# EAGLE design CAN Tester Board Rev3 (EAGLE 9.6.2)
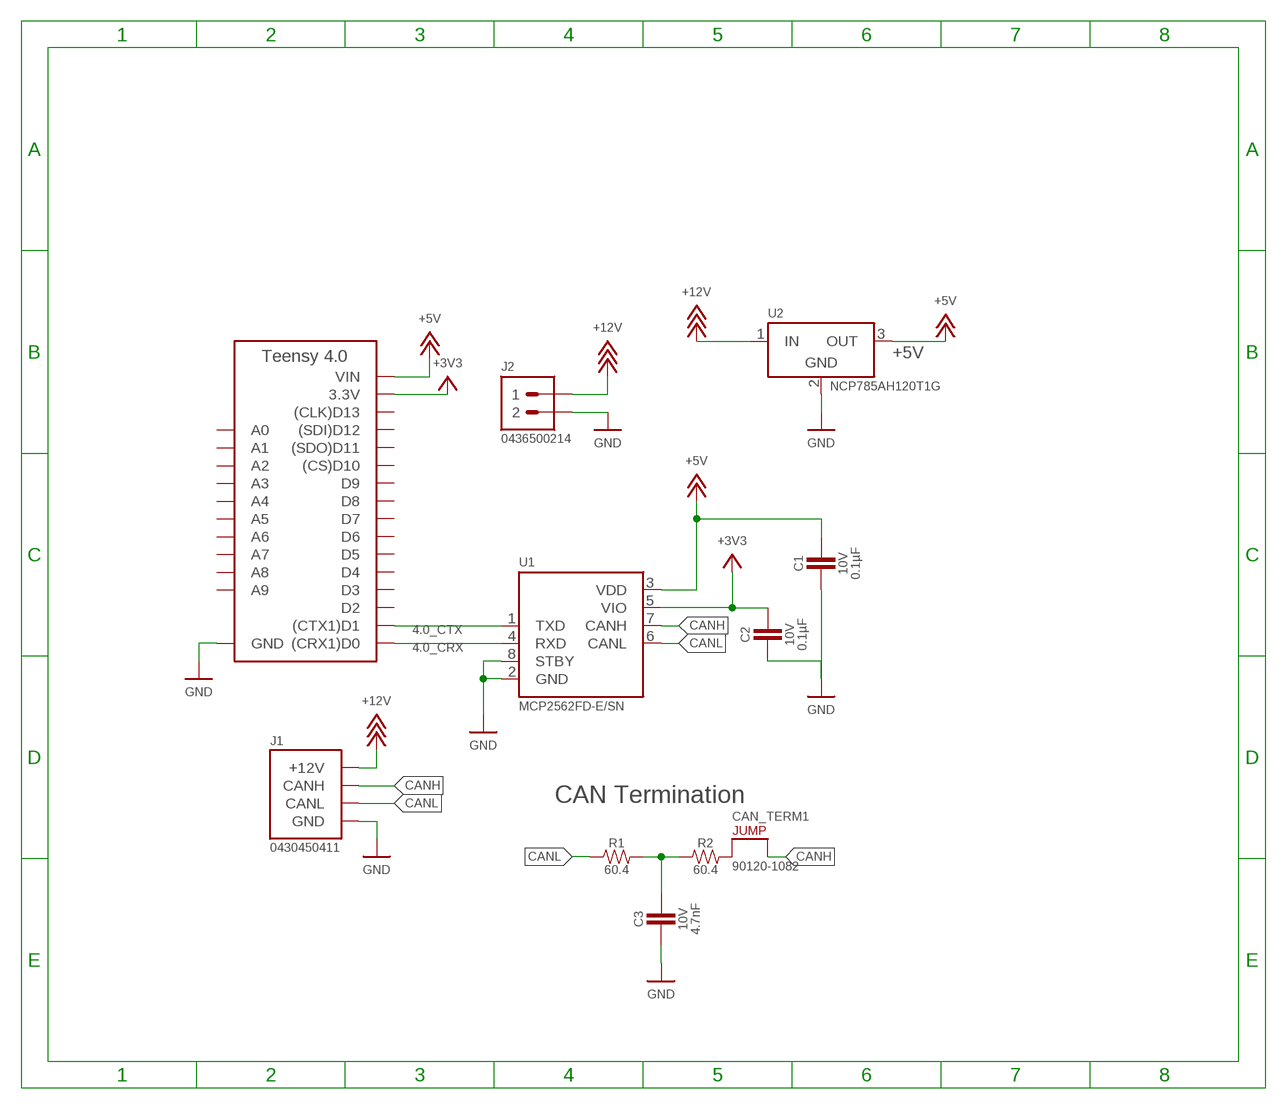
[diagram p0: schematic, sheet 1]

## Parts
A1  TEENSY_4.0  [TEENSY_SHORT]
C1  CAPACITOR_0603_10V_0.1UF  [0603-CAP]
C2  CAPACITOR_0603_10V_0.1UF  [0603-CAP]
C3  CAPACITOR_0603_10V_4.7NF  [0603-CAP]
CAN_TERM1  JUMPER__1X02  [1X02]
J1  CONNECTOR-CAN_μF_S_RA_  [MOLEX_MICROFIT_SMD_RIGHTANGLE_04_DUAL]
J2  CONNECTOR-2_MICROFIT_SMD_RIGHTANGLE_02_SINGLE_BLACK  [MOLEX_MICROFIT_SMD_RIGHTANGLE_02_SINGLE]
R1  RESISTOR_0603_60.4  [0603-RES]
R2  RESISTOR_0603_60.4  [0603-RES]
U1  MCP2562FD  [SOIC-08(NARROW,0.15")]
U2  VOLTAGE_REGULATOR_SOT-89_12V  [SOT-89]

## Nets
4.0_CRX: A1.D0((CRX1)D0) U1.4(RXD)
4.0_CTX: A1.D1((CTX1)D1) U1.1(TXD)
+3V3: A1.3.3V C2.1 U1.5(VIO)
+5V: A1.VIN C1.1 U1.3(VDD) U2.3(OUT)
+12V: J1.1(+12V) J2.1 U2.1(IN)
CANH [New Class]: CAN_TERM1.2 J1.4(CANH) U1.7(CANH)
CANL: J1.3(CANL) R1.1 U1.6(CANL)
GND: A1.AGND/GND(GND) A1.GND C1.2 C2.2 C3.2 J1.2(GND) J2.2 U1.2(GND) U1.8(STBY) U2.2(GND)
N$3: C3.1 R1.2 R2.1
N$5: CAN_TERM1.1 R2.2
Unconnected: A1.D2 A1.D3 A1.D4 A1.D5 A1.D6 A1.D7 A1.D8 A1.D9 A1.D10((CS)D10) A1.D11((SDO)D11) A1.D12((SDI)D12) A1.D13((CLK)D13) A1.D14(A0) A1.D15(A1) A1.D16(A2) A1.D17(A3) A1.D18(A4) A1.D19(A5) A1.D20(A6) A1.D21(A7) A1.D22(A8) A1.D23(A9)

## Notes on the sheet
- CAN Termination

## Library data of the parts
A1 = HyTechDevices:TEENSY_4.0: Teensy 4.0 Datasheet <https://www.pjrc.com/store/teensy40.html> Requires ordering of: 2: 14 pin, 0.1" pitch female headers; TEENSY: 4.0
C1 C2 = HyTechDevices:CAPACITOR_?_*: Capacitor, Non-Polarized VJ...1BC Series Datasheet <https://www.mouser.com/datasheet/2/427/vjw1bcbascomseries-1762447.pdf> Samsung Datasheet <https://www.mouser.com/datasheet/2/585/MLCC-1837944.pdf> Walsin Datasheet <https://www.mouser.com/datasheet/2/210/WTC_MLCC_General_Purpose-1534899.pdf> GRM188R61A226ME15D <https://www.mouser.com/datasheet/2/281/1/GRM188R61A226ME15_02A-1985787.pdf> GRM188R61E106MA73D <https://www.mouser.com/datasheet/2/281/1/GRM188R61E106MA73_01A-1985806.pdf> 885012006013 <https://www.mouser.com/datasheet/2/445/885012006013-1726946.pdf> 2220Y6300105KXTWS2 <https://www.mouser.com/datasheet/2/218/SMD_High_and_Std_StackiCap_P62-1825512.pdf> Yageo Class 2, X5R <https://www.mouser.com/datasheet/2/447/UPY_GPHC_X5R_4V_to_50V_26-1827097.pdf> TDK C Series <https://www.mouser.com/ProductDetail/TDK/C3216X5R1V226M160AC?qs=%2Fha2pyFadujbcx9jh7lYl%2F4NeMoXFhdc8AqVWNq4wW6M2y7zl6GzBuhgtI0ngznN> AVX Automotive MLCC <https://www.mouser.com/datasheet/2/40/AutoMLCC-777028.pdf> KEMET X7R Series <https://www.mouser.com/datasheet/2/212/KEM_C1002_X7R_SMD-1102033.pdf> Kyocera AVX <https://www.mouser.com/datasheet/2/40/C0GNP0_Dielectric-951274.pdf>; CAPACITANCE: 0.1µF; DKPN: 720-1688-1-ND; MANUFACTURER: Vishay Vitramon; MOPN: 77-VJ0603Y104JXQPBC; MPN: VJ0603Y104JXQPW1BC; TOLERANCE: 5%; VOLTAGE: 10V
C3 = HyTechDevices:CAPACITOR_?_*: Capacitor, Non-Polarized VJ...1BC Series Datasheet <https://www.mouser.com/datasheet/2/427/vjw1bcbascomseries-1762447.pdf> Samsung Datasheet <https://www.mouser.com/datasheet/2/585/MLCC-1837944.pdf> Walsin Datasheet <https://www.mouser.com/datasheet/2/210/WTC_MLCC_General_Purpose-1534899.pdf> GRM188R61A226ME15D <https://www.mouser.com/datasheet/2/281/1/GRM188R61A226ME15_02A-1985787.pdf> GRM188R61E106MA73D <https://www.mouser.com/datasheet/2/281/1/GRM188R61E106MA73_01A-1985806.pdf> 885012006013 <https://www.mouser.com/datasheet/2/445/885012006013-1726946.pdf> 2220Y6300105KXTWS2 <https://www.mouser.com/datasheet/2/218/SMD_High_and_Std_StackiCap_P62-1825512.pdf> Yageo Class 2, X5R <https://www.mouser.com/datasheet/2/447/UPY_GPHC_X5R_4V_to_50V_26-1827097.pdf> TDK C Series <https://www.mouser.com/ProductDetail/TDK/C3216X5R1V226M160AC?qs=%2Fha2pyFadujbcx9jh7lYl%2F4NeMoXFhdc8AqVWNq4wW6M2y7zl6GzBuhgtI0ngznN> AVX Automotive MLCC <https://www.mouser.com/datasheet/2/40/AutoMLCC-777028.pdf> KEMET X7R Series <https://www.mouser.com/datasheet/2/212/KEM_C1002_X7R_SMD-1102033.pdf> Kyocera AVX <https://www.mouser.com/datasheet/2/40/C0GNP0_Dielectric-951274.pdf>; CAPACITANCE: 4.7nF; DKPN: 732-7931-1-ND; MANUFACTURER: Würth Elektronik; MOPN: 710-885012206012; MPN: 885012206012; TOLERANCE: 10%; VOLTAGE: 10V
CAN_TERM1 = HyTechDevices_Jumper:JUMPER_?_*: 2 Pin Connector; DKPN: WM23656-ND; MANUFACTURER: Molex; MOPN: 538-90120-1082; MPN: 90120-1082
J1 = HyTechDevices:CONNECTOR-CAN_?_*: HyTech CAN Connector; DKPN: WM1832CT-ND; MANUFACTURER: Molex; MOPN: 538-43045-0411; MPN: 0430450411
J2 = HyTechDevices:CONNECTOR-2_?_*: 2 Pin Connector; DKPN: WM14310CT-ND; MANUFACTURER: Molex; MOPN: 538-43650-0214; MPN: 0436500214
R1 R2 = HyTechDevices:RESISTOR_?_*: Resistor PWR163 Series <https://www.mouser.com/datasheet/2/54/pwr163-777985.pdf> AC Series <https://www.mouser.com/datasheet/2/447/Yageo_PYu_AC_51_RoHS_L_7_1714230-1874691.pdf> PU Series <https://www.mouser.com/datasheet/2/447/PYu-PU_51_RoHS_L_6-1504619.pdf> ERA Series <https://www.mouser.com/datasheet/2/315/AOA0000C307-1149632.pdf> PWR263 Series <https://www.mouser.com/datasheet/2/54/pwr263s_35-778069.pdf> KTR Series <https://www.mouser.com/datasheet/2/348/ROHM_S_A0011075115_1-2563276.pdf> RC Series <https://www.mouser.com/datasheet/2/447/Yageo_03_18_2021_PYu_RC_Group_51_RoHS_L_11-2199992.pdf> ERJ PB3, PB6 Series <https://www.mouser.com/datasheet/2/315/AOA0000C328-1530132.pdf> ERJ PA2, P03, PA3, P06, P08, P14 Series <https://www.mouser.com/datasheet/2/315/AOA0000C331-1141874.pdf>; DKPN: 311-60.4HRCT-ND; MANUFACTURER: Yageo; MOPN: 603-RC0603FR-0760R4L; MPN: RC0603FR-0760R4L; POWER: 0.1W; RESISTANCE: 60.4; TOLERANCE: 1%; VOLTAGE_CONTINUOUS: 2.48V; VOLTAGE_MAX: 75V
U1 = HyTechDevices:MCP2562FD: MCP2562FD Can Tranciever Datasheet <https://ww1.microchip.com/downloads/en/DeviceDoc/20005284A.pdf>; ALT_DKPN: MCP2562-E/SN-ND; ALT_MANUFACTURER: Microchip Technology; ALT_MOPN: 579-MCP2562-E/SN; ALT_MPN: MCP2562-E/SN; DKPN: MCP2562FD-E/SN-ND; MANUFACTURER: Microchip Technology; MOPN: 579-MCP2562FD-E/SN; MPN: MCP2562FD-E/SN
U2 = HyTechDevices:VOLTAGE_REGULATOR_?_*: Voltage Regulators LDL1117S50R Datasheet <https://www.mouser.com/datasheet/2/389/dm00366442-1799212.pdf> NCP785AH120T1G <https://www.mouser.com/datasheet/2/308/NCP785A_D-1812704.pdf> LMS8117A Datasheet <https://www.ti.com/lit/ds/symlink/lms8117a.pdf?HQS>; DKPN: NCP785AH120T1GOSCT-ND; MANUFACTURER: ON Semiconductor; MOPN: 863-NCP785AH120T1G; MPN: NCP785AH120T1G

## Board
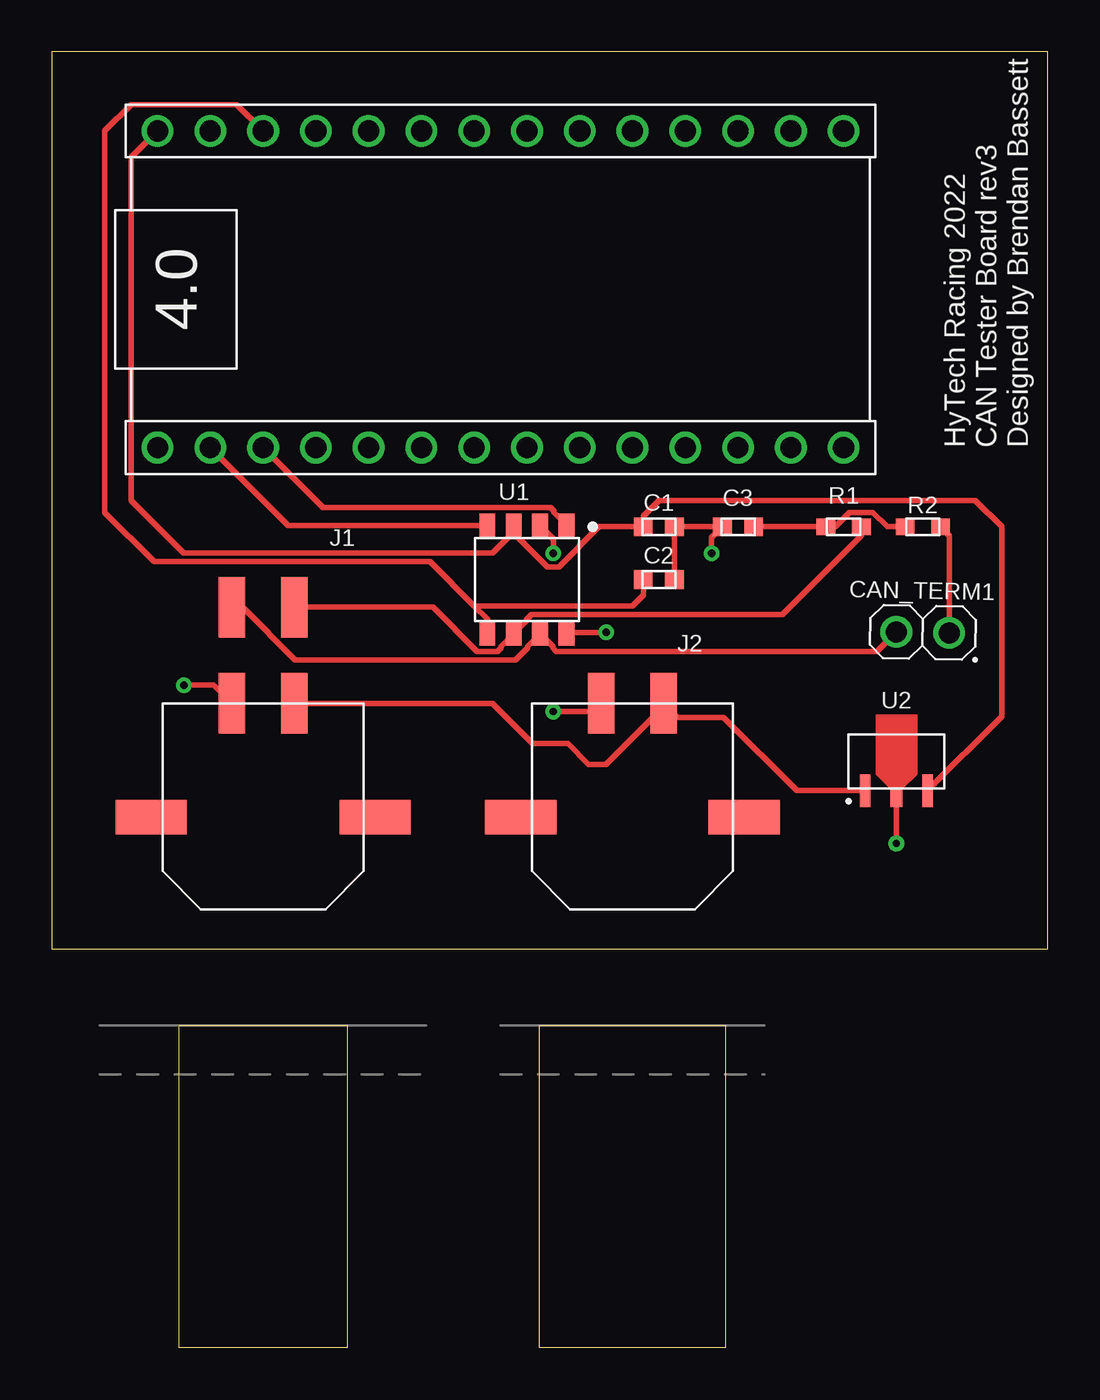
[diagram p1: board, top side]
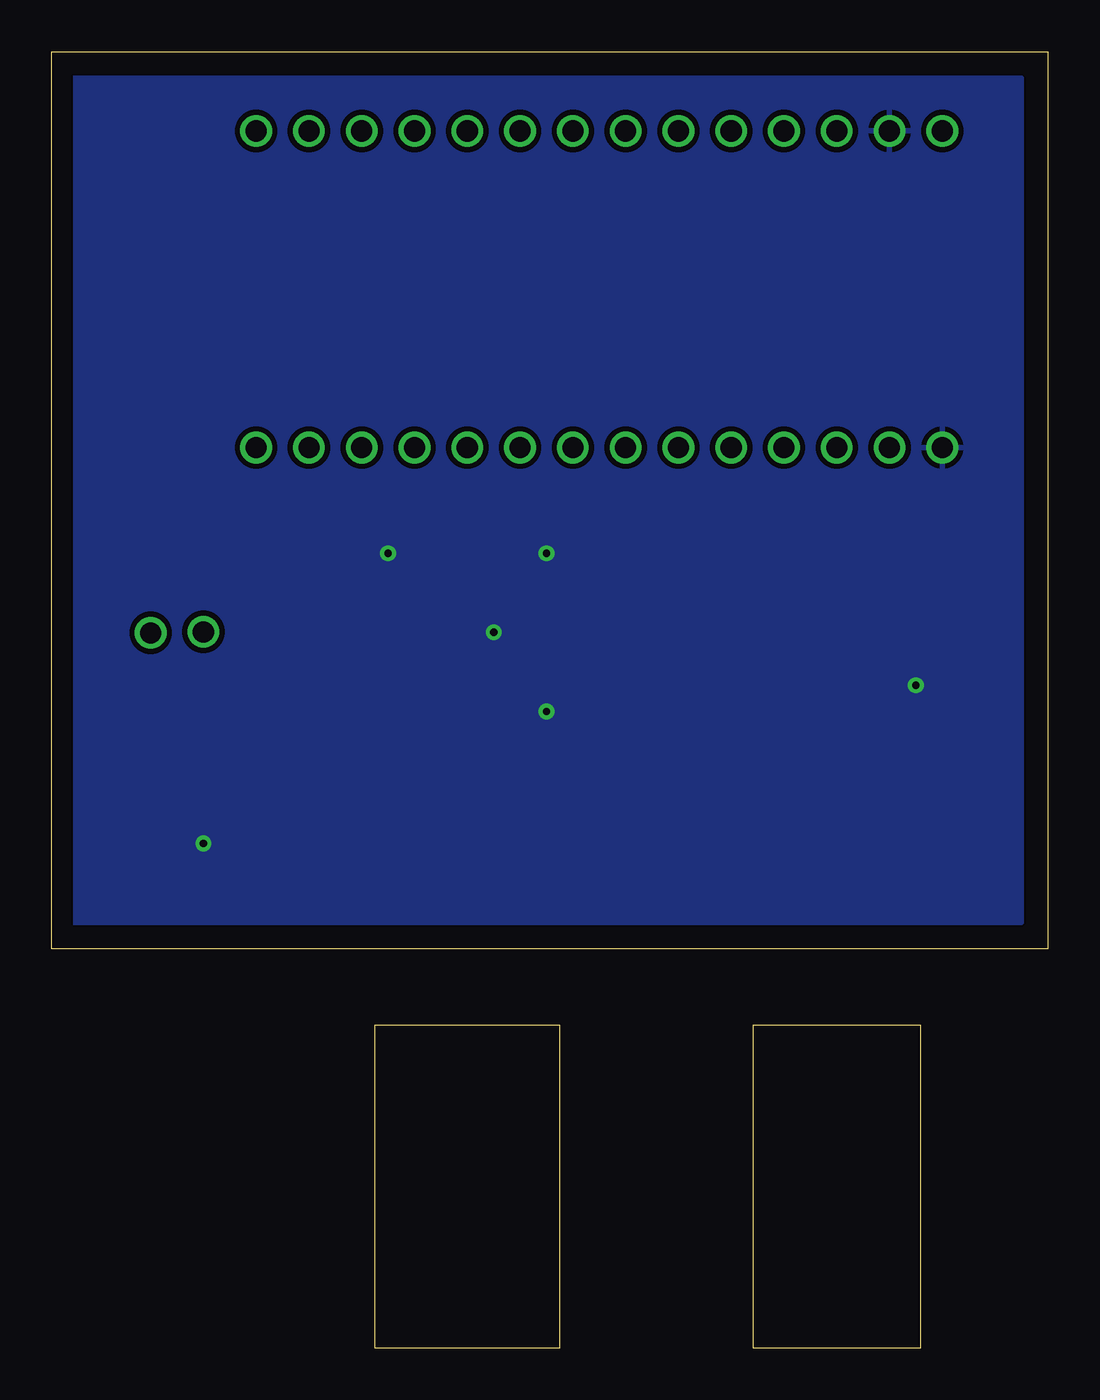
[diagram p2: board, bottom side, seen from below]

Size 47.93 x 43.17 mm. Coordinates in mm from the lower left corner, seen from the top.
Outline: 0,0 47.93,0 47.93,43.17 0,43.17 0,0
Copper layers (1*16): Top 0.035mm / dielectric 1.5mm / Bottom 0.035mm
Design rules "default": minimum track width 6mil, minimum drill 0.35mm, track to track 6mil, track to pad 6mil, pad to pad 6mil, via to via 6mil, smd to smd 6mil, copper to edge 40mil, drill to drill 6mil, minimum pad ring 10mil, minimum via ring 8mil, stop-mask expansion 4mil, vias tented up to drill 0mil, thermal gap 10mil

### Footprints (pad centres in the part's own frame; a part is rotated, then mirrored left to right if it is on the bottom)
TEENSY_SHORT = drill 1.016: 3.3V 0,5.08; AGND/GND 0,2.54; D0 15.24,2.54; D1 15.24,5.08; D2 15.24,7.62; D3 15.24,10.16; D4 15.24,12.7; D5 15.24,15.24; D6 15.24,17.78; D7 15.24,20.32; D8 15.24,22.86; D9 15.24,25.4; D10 15.24,27.94; D11 15.24,30.48; D12 15.24,33.02; D13 0,33.02; D14 0,30.48; D15 0,27.94; D16 0,25.4; D17 0,22.86; D18 0,20.32; D19 0,17.78; D20 0,15.24; D21 0,12.7; D22 0,10.16; D23 0,7.62; GND 15.24,0; VIN 0,0
0603-CAP = smd 0.9 x 0.9: 1 -0.75,0; 2 0.75,0
1X02 = drill 1.016: 1 -1.27,0; 2 1.27,0
MOLEX_MICROFIT_SMD_RIGHTANGLE_04_DUAL = smd 1.27 x 2.921: 1 1.5,5.474; 2 -1.5,5.474; 3 1.5,10.097; 4 -1.5,10.097 | smd 3.429 x 1.651: PAD1 5.386,0; PAD2 -5.386,0
MOLEX_MICROFIT_SMD_RIGHTANGLE_02_SINGLE = smd 1.27 x 2.921: 1 1.499,5.474; 2 -1.499,5.474 | smd 3.429 x 1.651: PAD1 5.372,0; PAD2 -5.372,0
0603-RES = smd 0.9 x 0.8: 1 -0.85,0; 2 0.85,0
SOIC-08(NARROW,0.15") = smd 0.762 x 1.143: 1 -1.905,-2.603; 2 -0.635,-2.603; 3 0.635,-2.603; 4 1.905,-2.603; 5 1.905,2.603; 6 0.635,2.603; 7 -0.635,2.603; 8 -1.905,2.603
SOT-89 = smd 0.5 x 1.57: 1 -1.5,0; 3 1.5,0 | smd 0.58 x 0.86: 2 0,-0.355

### Placement (x,y rotation side)
A1  5.08,39.37 270 top
C1  29.21,20.32 0 top
C2  29.21,17.78 0 top
C3  33.02,20.32 180 top
CAN_TERM1  41.91,15.24 178.9 top
J1  10.16,6.35 0 top
J2  27.94,6.35 0 top
R1  38.1,20.32 180 top
R2  41.91,20.32 0 top
U1  22.86,17.78 180 top
U2  40.64,7.62 0 top

### Tracks (layer width: path | path; a pad name or v marks a point on that pad's centre or on a via)
4.0_CRX
  Top 0.254: A1.D0 11.37,20.38 U1.4
4.0_CTX
  Top 0.254: U1.1 24.16,20.99 24.16,21.07 23.99,21.23 13.06,21.23 A1.D1
+3V3
  Top 0.254: A1.3.3V 8.89,40.64 3.81,40.64 2.54,39.37 2.54,21.02 4.91,18.64 18.19,18.64 20.32,16.51 | U1.5 20.95,15.88 20.32,16.51 | 20.32,16.51 27.94,16.51 28.46,17.03 C2.1
+5V
  Top 0.254: A1.VIN 3.81,38.1 3.81,21.59 6.35,19.05 21.2,19.05 22.23,20.08 U1.3 22.23,20.02 23.86,18.39 24.4,18.39 26.33,20.32 C1.1 28.46,20.84 29.21,21.59 44.45,21.59 45.72,20.32 45.72,11.2 U2.3
+12V
  Top 0.254: U2.1 35.84,7.62 32.31,11.15 30.11,11.15 J2.1 29.44,11.66 26.67,8.89 25.83,8.89 24.84,9.88 23.14,9.88 21.2,11.82 J1.1
CANH
  Top 0.254: J1.4 9.17,16.45 11.7,13.92 22.32,13.92 22.89,14.49 22.89,14.57 U1.7 24.11,14.57 24.11,14.49 24.27,14.33 39.7,14.33 CAN_TERM1.2
CANL
  Top 0.254: J1.3 18.34,16.45 20.46,14.33 21.45,14.33 21.61,14.49 21.61,14.57 U1.6 22.84,15.79 22.84,15.86 23.07,16.1 35.15,16.1 38.95,19.9 R1.1
GND  (via drill 0.35)
  Top 0.254: v6.35,12.7 7.78,12.7 J1.2 | U1.2 24.11,19.77 24.11,19.7 24.13,19.67 v24.13,19.05 | C2.2 C1.2 C3.2 31.75,19.8 v31.75,19.05 | J2.2 26.05,11.43 v24.13,11.43 | U1.8 24.83,15.24 v26.67,15.24 | U2.2 v40.64,5.08
  pour Bottom (isolate 0.254): 1.27,41.91 46.99,41.91 46.99,1.27 1.27,1.27
N$3
  Top 0.254: C3.1 R1.2 37.7,20.32 38.38,21 39.52,21 40.2,20.32 R2.1
N$5
  Top 0.254: R2.2 43.18,19.9 CAN_TERM1.1

### Text on the board
tNames: HyTech Racing 2022 / CAN Tester Board rev3 / Designed by Brendan Bassett